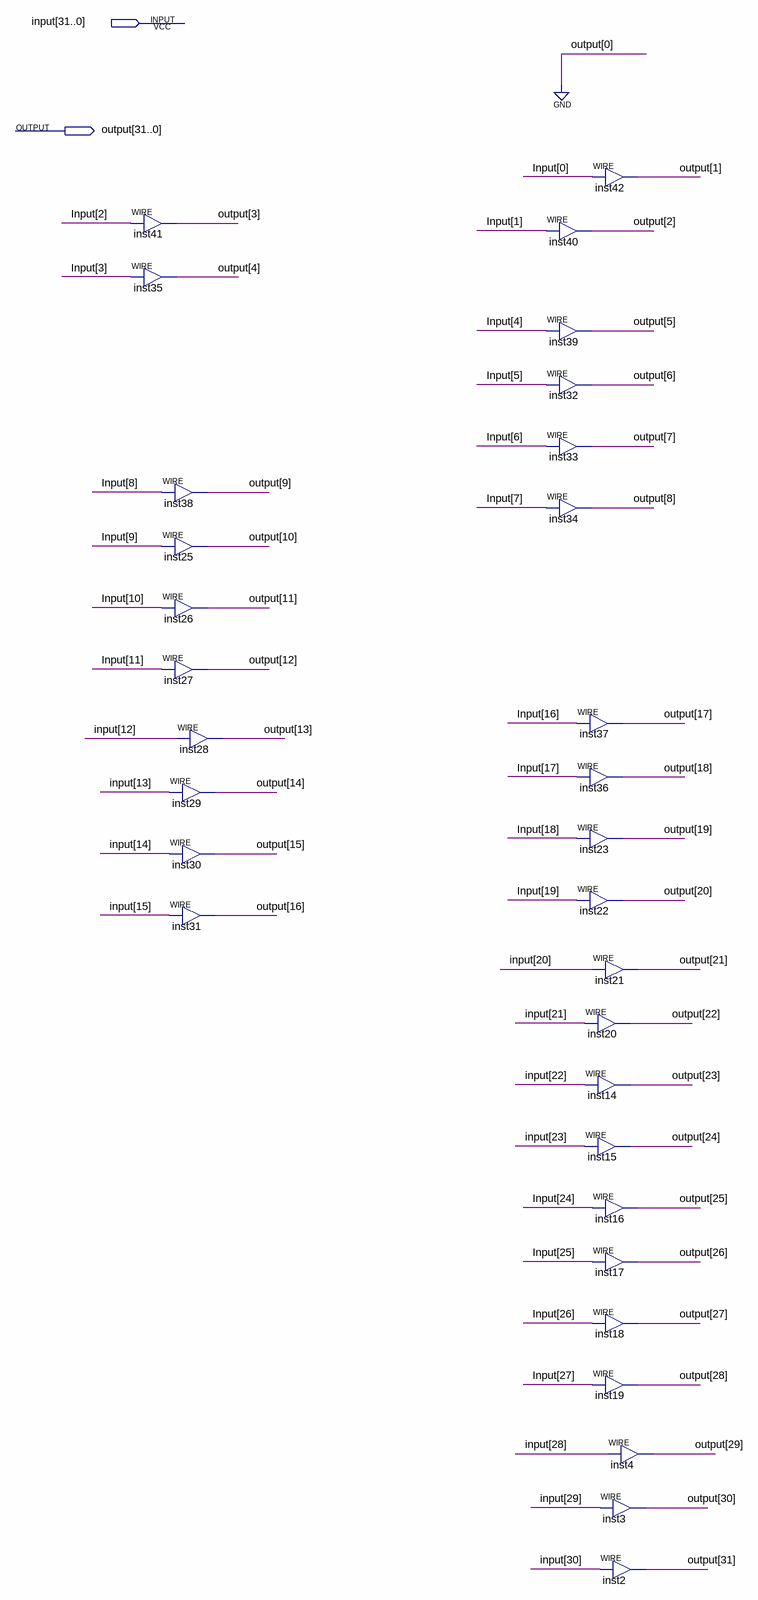
[diagram p0: schematic sheet]
// Quartus schematic 1bitshift.bdf as structural Verilog: 31 symbols, 2 pins
module \1bitshift  (
  input  [31:0] \input ,
  output [31:0] \output 
);

  assign \output [3] = \input [2];  // WIRE inst41
  assign \output [4] = \input [3];  // WIRE inst35
  assign \output [9] = \input [8];  // WIRE inst38
  assign \output [10] = \input [9];  // WIRE inst25
  assign \output [11] = \input [10];  // WIRE inst26
  assign \output [12] = \input [11];  // WIRE inst27
  assign \output [13] = \input [12];  // WIRE inst28
  assign \output [14] = \input [13];  // WIRE inst29
  assign \output [15] = \input [14];  // WIRE inst30
  assign \output [16] = \input [15];  // WIRE inst31
  assign \output [2] = \input [1];  // WIRE inst40
  assign \output [5] = \input [4];  // WIRE inst39
  assign \output [6] = \input [5];  // WIRE inst32
  assign \output [7] = \input [6];  // WIRE inst33
  assign \output [8] = \input [7];  // WIRE inst34
  assign \output [1] = \input [0];  // WIRE inst42
  assign \output [17] = \input [16];  // WIRE inst37
  assign \output [18] = \input [17];  // WIRE inst36
  assign \output [19] = \input [18];  // WIRE inst23
  assign \output [20] = \input [19];  // WIRE inst22
  assign \output [21] = \input [20];  // WIRE inst21
  assign \output [22] = \input [21];  // WIRE inst20
  assign \output [23] = \input [22];  // WIRE inst14
  assign \output [24] = \input [23];  // WIRE inst15
  assign \output [25] = \input [24];  // WIRE inst16
  assign \output [26] = \input [25];  // WIRE inst17
  assign \output [27] = \input [26];  // WIRE inst18
  assign \output [28] = \input [27];  // WIRE inst19
  assign \output [29] = \input [28];  // WIRE inst4
  assign \output [30] = \input [29];  // WIRE inst3
  assign \output [31] = \input [30];  // WIRE inst2

  assign \output [0] = 1'b0;
endmodule
